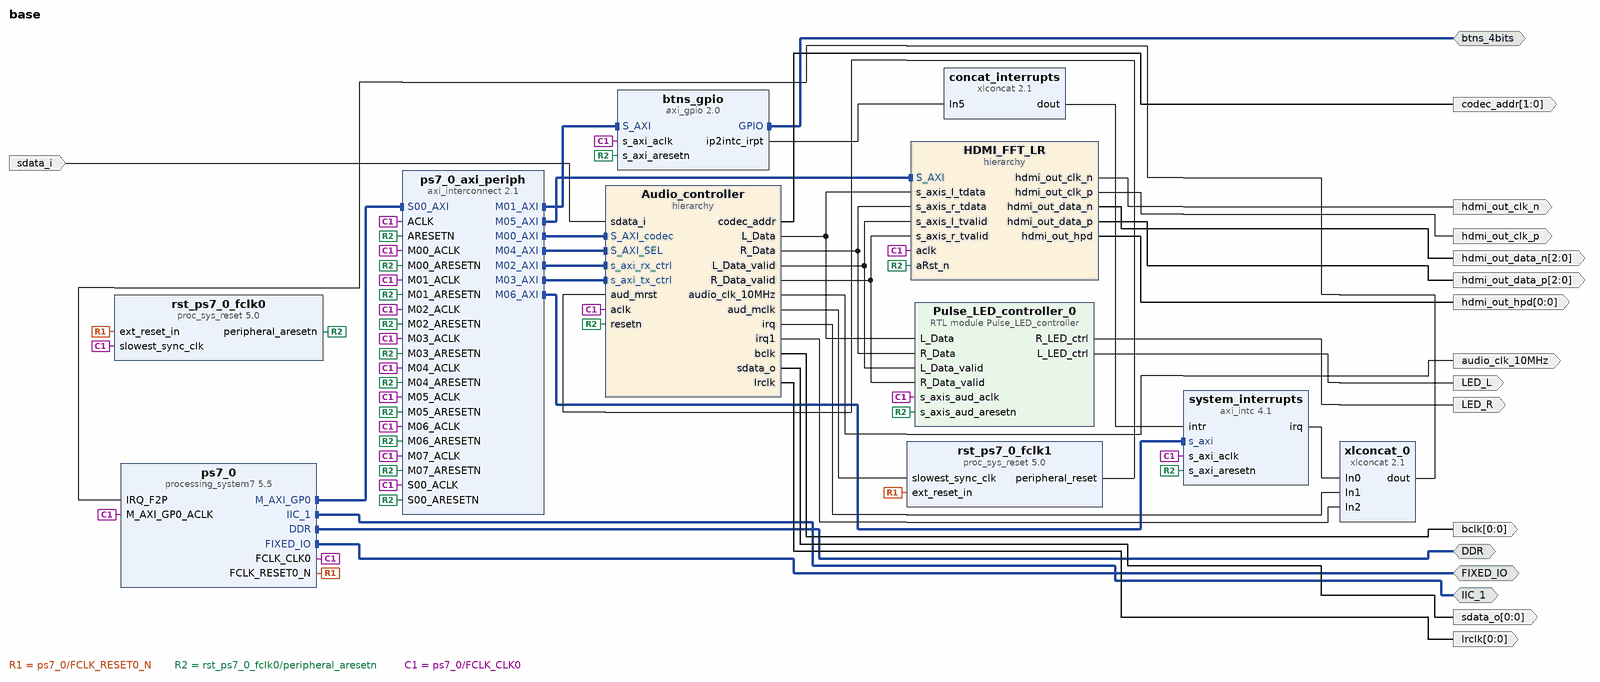
[diagram p0: block diagram of the top level]
# Vivado block design base, xc7z020clg400-1, Vivado 2020.2
create_bd_design base

create_bd_intf_port -mode Master -vlnv xilinx.com:interface:ddrx_rtl:1.0 DDR
create_bd_intf_port -mode Master -vlnv xilinx.com:display_processing_system7:fixedio_rtl:1.0 FIXED_IO
create_bd_intf_port -mode Master -vlnv xilinx.com:interface:iic_rtl:1.0 IIC_1
create_bd_intf_port -mode Master -vlnv xilinx.com:interface:gpio_rtl:1.0 btns_4bits
create_bd_port -dir O -type clk audio_clk_10MHz
create_bd_port -dir O -from 0 -to 0 bclk
create_bd_port -dir O -from 1 -to 0 codec_addr
create_bd_port -dir O -from 0 -to 0 lrclk
create_bd_port -dir I sdata_i
create_bd_port -dir O -from 0 -to 0 sdata_o
create_bd_port -dir O LED_L
create_bd_port -dir O LED_R
create_bd_port -dir O -type clk hdmi_out_clk_p
create_bd_port -dir O -type clk hdmi_out_clk_n
create_bd_port -dir O -from 2 -to 0 -type data hdmi_out_data_p
create_bd_port -dir O -from 2 -to 0 -type data hdmi_out_data_n
create_bd_port -dir O -from 0 -to 0 hdmi_out_hpd

create_bd_cell -type ip -vlnv xilinx.com:ip:processing_system7:5.5 ps7_0
set_property -dict [list \
  CONFIG.PCW_APU_PERIPHERAL_FREQMHZ 650 \
  CONFIG.PCW_CRYSTAL_PERIPHERAL_FREQMHZ 50 \
  CONFIG.PCW_ENET0_ENET0_IO {MIO 16 .. 27} \
  CONFIG.PCW_ENET0_GRP_MDIO_ENABLE 1 \
  CONFIG.PCW_ENET0_GRP_MDIO_IO {MIO 52 .. 53} \
  CONFIG.PCW_ENET0_PERIPHERAL_ENABLE 1 \
  CONFIG.PCW_FPGA0_PERIPHERAL_FREQMHZ 100 \
  CONFIG.PCW_FPGA1_PERIPHERAL_FREQMHZ 142 \
  CONFIG.PCW_FPGA2_PERIPHERAL_FREQMHZ 200 \
  CONFIG.PCW_FPGA3_PERIPHERAL_FREQMHZ 100 \
  CONFIG.PCW_GPIO_EMIO_GPIO_ENABLE 1 \
  CONFIG.PCW_GPIO_EMIO_GPIO_IO 10 \
  CONFIG.PCW_GPIO_EMIO_GPIO_WIDTH 10 \
  CONFIG.PCW_GPIO_MIO_GPIO_ENABLE 0 \
  CONFIG.PCW_I2C0_GRP_INT_ENABLE 1 \
  CONFIG.PCW_I2C0_GRP_INT_IO EMIO \
  CONFIG.PCW_I2C0_I2C0_IO {MIO 50 .. 51} \
  CONFIG.PCW_I2C0_PERIPHERAL_ENABLE 1 \
  CONFIG.PCW_I2C1_I2C1_IO EMIO \
  CONFIG.PCW_I2C1_PERIPHERAL_ENABLE 1 \
  CONFIG.PCW_I2C_PERIPHERAL_FREQMHZ 108.333336 \
  CONFIG.PCW_IRQ_F2P_INTR 1 \
  CONFIG.PCW_PERIPHERAL_BOARD_PRESET None \
  CONFIG.PCW_PRESET_BANK1_VOLTAGE {LVCMOS 1.8V} \
  CONFIG.PCW_QSPI_GRP_FBCLK_ENABLE 1 \
  CONFIG.PCW_QSPI_GRP_FBCLK_IO {MIO 8} \
  CONFIG.PCW_QSPI_GRP_SINGLE_SS_ENABLE 1 \
  CONFIG.PCW_QSPI_GRP_SINGLE_SS_IO {MIO 1 .. 6} \
  CONFIG.PCW_QSPI_PERIPHERAL_ENABLE 1 \
  CONFIG.PCW_QSPI_QSPI_IO {MIO 1 .. 6} \
  CONFIG.PCW_SD0_GRP_CD_ENABLE 1 \
  CONFIG.PCW_SD0_GRP_CD_IO {MIO 47} \
  CONFIG.PCW_SD0_GRP_WP_ENABLE 0 \
  CONFIG.PCW_SD0_PERIPHERAL_ENABLE 1 \
  CONFIG.PCW_SD0_SD0_IO {MIO 40 .. 45} \
  CONFIG.PCW_SDIO_PERIPHERAL_FREQMHZ 50 \
  CONFIG.PCW_SINGLE_QSPI_DATA_MODE x4 \
  CONFIG.PCW_UART0_PERIPHERAL_ENABLE 1 \
  CONFIG.PCW_UART0_UART0_IO {MIO 14 .. 15} \
  CONFIG.PCW_UART1_PERIPHERAL_ENABLE 0 \
  CONFIG.PCW_UART_PERIPHERAL_FREQMHZ 100 \
  CONFIG.PCW_UIPARAM_DDR_BUS_WIDTH {16 Bit} \
  CONFIG.PCW_UIPARAM_DDR_FREQ_MHZ 525 \
  CONFIG.PCW_UIPARAM_DDR_PARTNO Custom \
  CONFIG.PCW_USB0_PERIPHERAL_ENABLE 1 \
  CONFIG.PCW_USB0_USB0_IO {MIO 28 .. 39} \
  CONFIG.PCW_USE_FABRIC_INTERRUPT 1 \
] [get_bd_cells ps7_0]
# 486 more settings of ps7_0 are not shown: defaults, MIO pin electricals, DDR timing, and values the tool derives
create_bd_cell -type ip -vlnv xilinx.com:ip:proc_sys_reset:5.0 rst_ps7_0_fclk0
create_bd_cell -type ip -vlnv xilinx.com:ip:proc_sys_reset:5.0 rst_ps7_0_fclk1
create_bd_cell -type hier Audio_controller
create_bd_cell -type ip -vlnv xilinx.com:ip:axi_gpio:2.0 btns_gpio
set_property -dict {CONFIG.C_ALL_INPUTS 1 CONFIG.C_GPIO_WIDTH 4 CONFIG.C_INTERRUPT_PRESENT 1} [get_bd_cells btns_gpio]
create_bd_cell -type ip -vlnv xilinx.com:ip:xlconcat:2.1 concat_interrupts
set_property -dict {CONFIG.NUM_PORTS 7 CONFIG.dout_width 15} [get_bd_cells concat_interrupts]
create_bd_cell -type ip -vlnv xilinx.com:ip:axi_interconnect:2.1 ps7_0_axi_periph
set_property -dict {CONFIG.NUM_MI 8 CONFIG.NUM_SI 1} [get_bd_cells ps7_0_axi_periph]
create_bd_cell -type ip -vlnv xilinx.com:ip:axi_intc:4.1 system_interrupts
create_bd_cell -type ip -vlnv xilinx.com:ip:xlconcat:2.1 xlconcat_0
set_property -dict {CONFIG.NUM_PORTS 16 CONFIG.dout_width 16} [get_bd_cells xlconcat_0]
create_bd_cell -type module -reference Pulse_LED_controller Pulse_LED_controller_0
create_bd_cell -type hier HDMI_FFT_LR

# ---- hierarchy /Audio_controller ----
current_bd_instance /Audio_controller
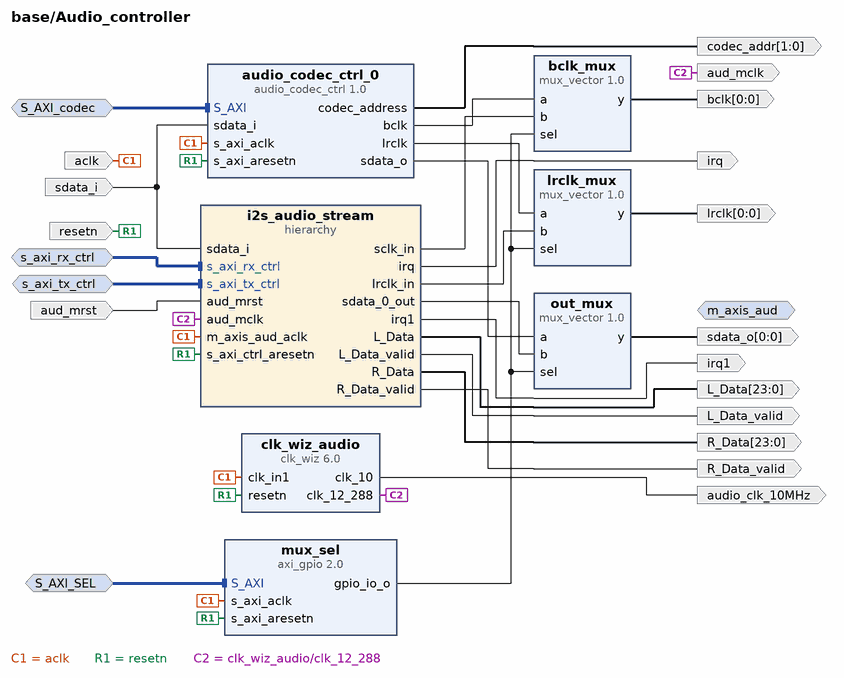
[diagram p1: block diagram inside /Audio_controller]
create_bd_intf_pin -mode Slave -vlnv xilinx.com:interface:aximm_rtl:1.0 S_AXI_codec
create_bd_intf_pin -mode Slave -vlnv xilinx.com:interface:aximm_rtl:1.0 S_AXI_SEL
create_bd_intf_pin -mode Slave -vlnv xilinx.com:interface:aximm_rtl:1.0 s_axi_rx_ctrl
create_bd_intf_pin -mode Slave -vlnv xilinx.com:interface:aximm_rtl:1.0 s_axi_tx_ctrl
create_bd_intf_pin -mode Master -vlnv xilinx.com:interface:axis_rtl:1.0 m_axis_aud
create_bd_pin -dir O -from 0 -to 0 bclk
create_bd_pin -dir I sdata_i
create_bd_pin -dir O -from 1 -to 0 codec_addr
create_bd_pin -dir I -type clk aclk
create_bd_pin -dir I -type rst resetn
create_bd_pin -dir O -from 0 -to 0 lrclk
create_bd_pin -dir O -type clk aud_mclk
create_bd_pin -dir O -from 0 -to 0 sdata_o
create_bd_pin -dir O -type clk audio_clk_10MHz
create_bd_pin -dir I -type rst aud_mrst
create_bd_pin -dir O -type intr irq
create_bd_pin -dir O -type intr irq1
create_bd_pin -dir O -from 23 -to 0 L_Data
create_bd_pin -dir O -from 23 -to 0 R_Data
create_bd_pin -dir O L_Data_valid
create_bd_pin -dir O R_Data_valid

create_bd_cell -type ip -vlnv xilinx.com:user:mux_vector:1.0 bclk_mux
set_property -dict {CONFIG.C_NUM_CHANNELS 2 CONFIG.C_SIZE 1 CONFIG.DELAY 0} [get_bd_cells bclk_mux]
create_bd_cell -type ip -vlnv xilinx.com:user:audio_codec_ctrl:1.0 audio_codec_ctrl_0
create_bd_cell -type ip -vlnv xilinx.com:user:mux_vector:1.0 lrclk_mux
set_property -dict {CONFIG.C_NUM_CHANNELS 2 CONFIG.C_SIZE 1 CONFIG.DELAY 0} [get_bd_cells lrclk_mux]
create_bd_cell -type ip -vlnv xilinx.com:user:mux_vector:1.0 out_mux
set_property -dict {CONFIG.C_NUM_CHANNELS 2 CONFIG.C_SIZE 1 CONFIG.DELAY 0} [get_bd_cells out_mux]
create_bd_cell -type hier i2s_audio_stream
create_bd_cell -type ip -vlnv xilinx.com:ip:clk_wiz:6.0 clk_wiz_audio
set_property -dict [list \
  CONFIG.CLKOUT1_JITTER 360.948 \
  CONFIG.CLKOUT1_PHASE_ERROR 301.601 \
  CONFIG.CLKOUT1_REQUESTED_OUT_FREQ 12.288 \
  CONFIG.CLKOUT2_JITTER 372.827 \
  CONFIG.CLKOUT2_PHASE_ERROR 301.601 \
  CONFIG.CLKOUT2_REQUESTED_OUT_FREQ 10 \
  CONFIG.CLKOUT2_USED true \
  CONFIG.CLK_OUT1_PORT clk_12_288 \
  CONFIG.CLK_OUT2_PORT clk_10 \
  CONFIG.MMCM_CLKFBOUT_MULT_F 48.000 \
  CONFIG.MMCM_CLKOUT0_DIVIDE_F 78.125 \
  CONFIG.MMCM_CLKOUT1_DIVIDE 96 \
  CONFIG.MMCM_DIVCLK_DIVIDE 5 \
  CONFIG.NUM_OUT_CLKS 2 \
  CONFIG.RESET_PORT resetn \
  CONFIG.RESET_TYPE ACTIVE_LOW \
  CONFIG.USE_LOCKED false \
] [get_bd_cells clk_wiz_audio]
create_bd_cell -type ip -vlnv xilinx.com:ip:axi_gpio:2.0 mux_sel
set_property -dict {CONFIG.C_ALL_OUTPUTS 1 CONFIG.C_GPIO_WIDTH 1} [get_bd_cells mux_sel]

# ---- hierarchy /Audio_controller/i2s_audio_stream ----
current_bd_instance /Audio_controller/i2s_audio_stream
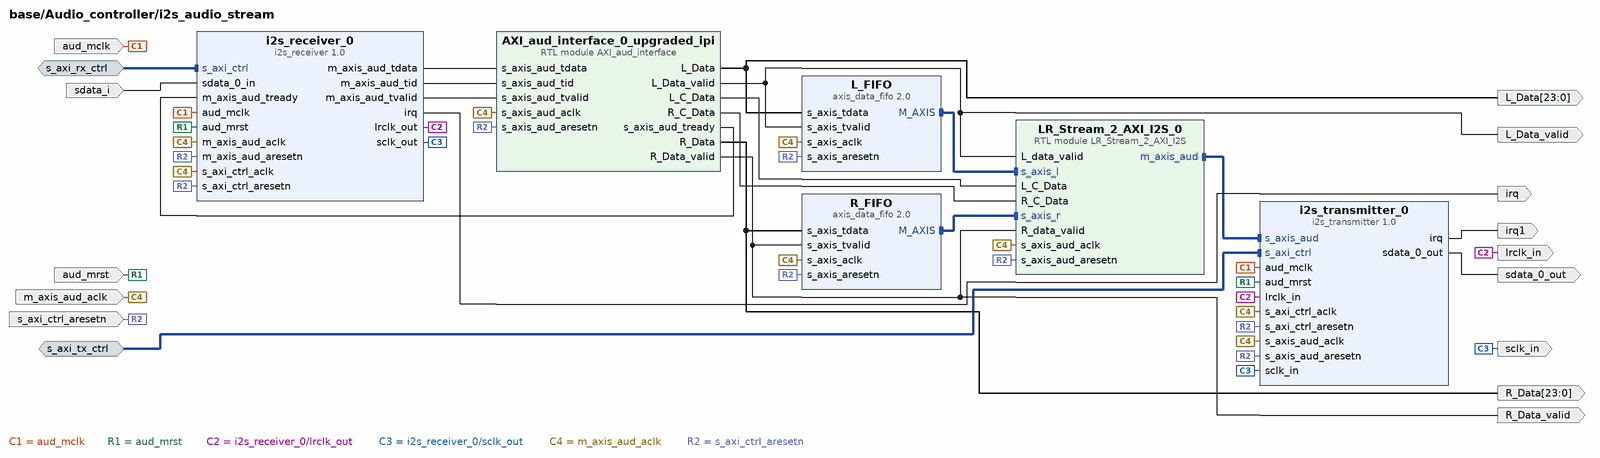
[diagram p2: block diagram inside /Audio_controller/i2s_audio_stream]
create_bd_intf_pin -mode Slave -vlnv xilinx.com:interface:aximm_rtl:1.0 s_axi_rx_ctrl
create_bd_intf_pin -mode Slave -vlnv xilinx.com:interface:aximm_rtl:1.0 s_axi_tx_ctrl
create_bd_pin -dir I -type clk m_axis_aud_aclk
create_bd_pin -dir I -type rst s_axi_ctrl_aresetn
create_bd_pin -dir I -type clk aud_mclk
create_bd_pin -dir I -type rst aud_mrst
create_bd_pin -dir O -type intr irq
create_bd_pin -dir O lrclk_in
create_bd_pin -dir O sclk_in
create_bd_pin -dir I sdata_i
create_bd_pin -dir O -type intr irq1
create_bd_pin -dir O sdata_0_out
create_bd_pin -dir O -from 23 -to 0 L_Data
create_bd_pin -dir O -from 23 -to 0 R_Data
create_bd_pin -dir O L_Data_valid
create_bd_pin -dir O R_Data_valid

create_bd_cell -type ip -vlnv xilinx.com:ip:i2s_receiver:1.0 i2s_receiver_0
set_property -dict {CONFIG.C_32BIT_LR 1 CONFIG.C_DEPTH 64 CONFIG.C_IS_MASTER 1} [get_bd_cells i2s_receiver_0]
create_bd_cell -type ip -vlnv xilinx.com:ip:i2s_transmitter:1.0 i2s_transmitter_0
set_property -dict [list \
  CONFIG.C_32BIT_LR 1 \
  CONFIG.C_DEPTH 64 \
  CONFIG.C_ENABLE_FIFO_COUNT false \
  CONFIG.C_IS_MASTER 0 \
] [get_bd_cells i2s_transmitter_0]
create_bd_cell -type ip -vlnv xilinx.com:ip:axis_data_fifo:2.0 L_FIFO
set_property -dict {CONFIG.FIFO_DEPTH 128 CONFIG.TDATA_NUM_BYTES 3} [get_bd_cells L_FIFO]
create_bd_cell -type ip -vlnv xilinx.com:ip:axis_data_fifo:2.0 R_FIFO
set_property -dict {CONFIG.FIFO_DEPTH 128 CONFIG.TDATA_NUM_BYTES 3} [get_bd_cells R_FIFO]
create_bd_cell -type module -reference LR_Stream_2_AXI_I2S LR_Stream_2_AXI_I2S_0
create_bd_cell -type module -reference AXI_aud_interface AXI_aud_interface_0_upgraded_ipi

# ---- hierarchy /HDMI_FFT_LR ----
current_bd_instance /HDMI_FFT_LR
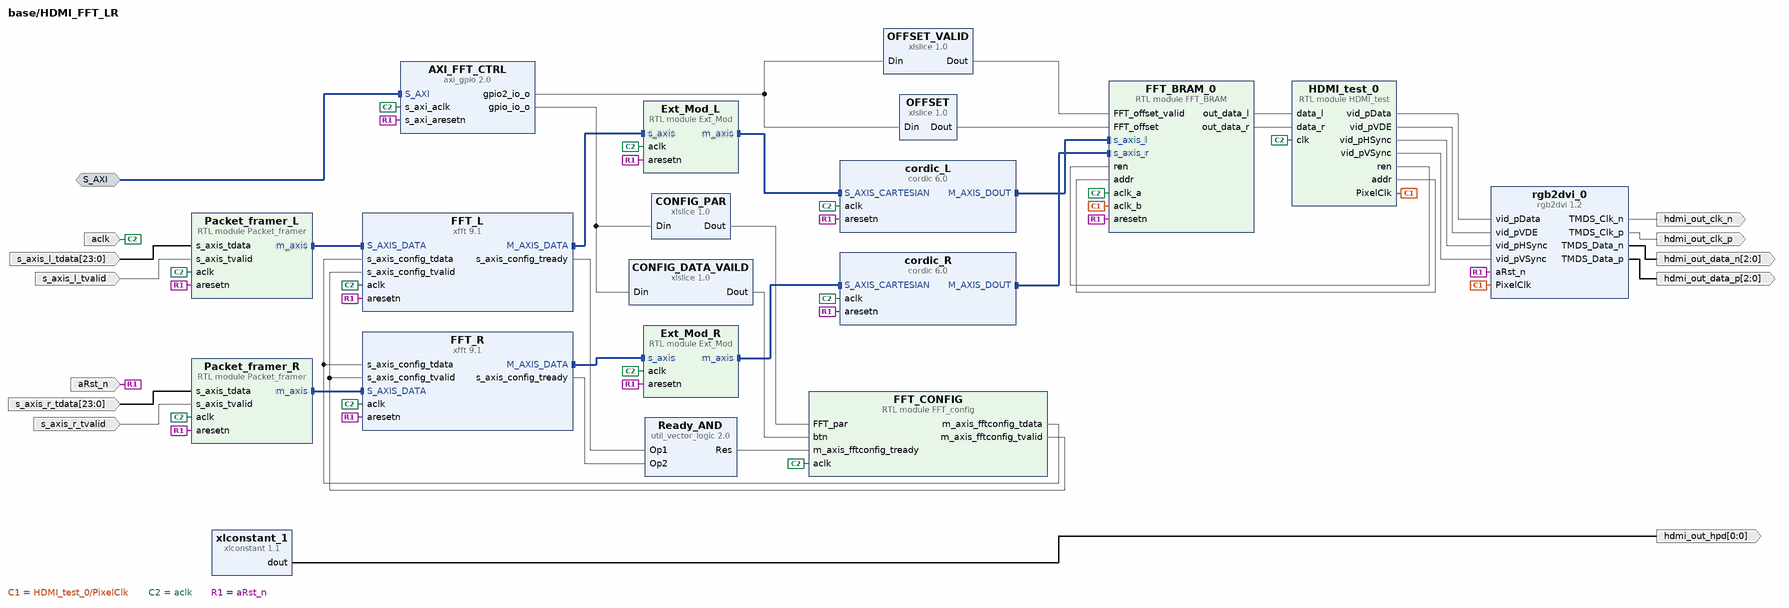
[diagram p3: block diagram inside /HDMI_FFT_LR]
create_bd_intf_pin -mode Slave -vlnv xilinx.com:interface:aximm_rtl:1.0 S_AXI
create_bd_pin -dir I -type clk aclk
create_bd_pin -dir I -type rst aRst_n
create_bd_pin -dir O -from 0 -to 0 hdmi_out_hpd
create_bd_pin -dir I -from 23 -to 0 s_axis_l_tdata
create_bd_pin -dir I s_axis_l_tvalid
create_bd_pin -dir O -type clk hdmi_out_clk_p
create_bd_pin -dir O -type clk hdmi_out_clk_n
create_bd_pin -dir O -from 2 -to 0 hdmi_out_data_p
create_bd_pin -dir O -from 2 -to 0 hdmi_out_data_n
create_bd_pin -dir I -from 23 -to 0 s_axis_r_tdata
create_bd_pin -dir I s_axis_r_tvalid

create_bd_cell -type module -reference FFT_config FFT_CONFIG
create_bd_cell -type ip -vlnv xilinx.com:ip:xfft:9.1 FFT_L
set_property -dict [list \
  CONFIG.aresetn true \
  CONFIG.channels 1 \
  CONFIG.data_format fixed_point \
  CONFIG.implementation_options pipelined_streaming_io \
  CONFIG.input_width 24 \
  CONFIG.number_of_stages_using_block_ram_for_data_and_phase_factors 3 \
  CONFIG.output_ordering natural_order \
  CONFIG.phase_factor_width 24 \
  CONFIG.scaling_options scaled \
  CONFIG.target_clock_frequency 100 \
  CONFIG.target_data_throughput 100 \
  CONFIG.transform_length 1024 \
  CONFIG.xk_index true \
] [get_bd_cells FFT_L]
create_bd_cell -type ip -vlnv xilinx.com:ip:util_vector_logic:2.0 Ready_AND
set_property -dict {CONFIG.C_SIZE 1} [get_bd_cells Ready_AND]
create_bd_cell -type ip -vlnv xilinx.com:ip:xlslice:1.0 OFFSET
set_property -dict {CONFIG.DIN_FROM 9 CONFIG.DIN_WIDTH 11 CONFIG.DOUT_WIDTH 10} [get_bd_cells OFFSET]
create_bd_cell -type ip -vlnv xilinx.com:ip:cordic:6.0 cordic_R
set_property -dict [list \
  CONFIG.ARESETN true \
  CONFIG.Coarse_Rotation false \
  CONFIG.Data_Format UnsignedInteger \
  CONFIG.Functional_Selection Square_Root \
  CONFIG.Input_Width 48 \
  CONFIG.Output_Width 25 \
  CONFIG.Round_Mode Truncate \
  CONFIG.cartesian_has_tlast true \
  CONFIG.cartesian_has_tuser true \
  CONFIG.cartesian_tuser_width 16 \
  CONFIG.flow_control Blocking \
  CONFIG.out_tlast_behv Pass_Cartesian_TLAST \
  CONFIG.out_tready true \
] [get_bd_cells cordic_R]
create_bd_cell -type module -reference Ext_Mod Ext_Mod_R
create_bd_cell -type ip -vlnv xilinx.com:ip:xlconstant:1.1 xlconstant_1
create_bd_cell -type ip -vlnv xilinx.com:ip:xlslice:1.0 OFFSET_VALID
set_property -dict {CONFIG.DIN_FROM 10 CONFIG.DIN_TO 10 CONFIG.DIN_WIDTH 11 CONFIG.DOUT_WIDTH 1} [get_bd_cells OFFSET_VALID]
create_bd_cell -type module -reference Packet_framer Packet_framer_L
set_property -dict {CONFIG.PACKET_N_DATA 1024} [get_bd_cells Packet_framer_L]
create_bd_cell -type ip -vlnv xilinx.com:ip:xfft:9.1 FFT_R
set_property -dict [list \
  CONFIG.aresetn true \
  CONFIG.channels 1 \
  CONFIG.data_format fixed_point \
  CONFIG.implementation_options pipelined_streaming_io \
  CONFIG.input_width 24 \
  CONFIG.number_of_stages_using_block_ram_for_data_and_phase_factors 3 \
  CONFIG.output_ordering natural_order \
  CONFIG.phase_factor_width 24 \
  CONFIG.scaling_options scaled \
  CONFIG.target_clock_frequency 100 \
  CONFIG.target_data_throughput 50 \
  CONFIG.transform_length 1024 \
  CONFIG.xk_index true \
] [get_bd_cells FFT_R]
create_bd_cell -type ip -vlnv digilentinc.com:ip:rgb2dvi:1.2 rgb2dvi_0
set_property -dict [list \
  CONFIG.kClkPrimitive MMCM \
  CONFIG.kClkRange 2 \
  CONFIG.kGenerateSerialClk true \
  CONFIG.kRstActiveHigh false \
] [get_bd_cells rgb2dvi_0]
create_bd_cell -type ip -vlnv xilinx.com:ip:xlslice:1.0 CONFIG_PAR
set_property -dict {CONFIG.DIN_FROM 15 CONFIG.DIN_WIDTH 17 CONFIG.DOUT_WIDTH 16} [get_bd_cells CONFIG_PAR]
create_bd_cell -type ip -vlnv xilinx.com:ip:xlslice:1.0 CONFIG_DATA_VAILD
set_property -dict {CONFIG.DIN_FROM 16 CONFIG.DIN_TO 16 CONFIG.DIN_WIDTH 17 CONFIG.DOUT_WIDTH 1} [get_bd_cells CONFIG_DATA_VAILD]
create_bd_cell -type ip -vlnv xilinx.com:ip:cordic:6.0 cordic_L
set_property -dict [list \
  CONFIG.ARESETN true \
  CONFIG.Coarse_Rotation false \
  CONFIG.Data_Format UnsignedInteger \
  CONFIG.Functional_Selection Square_Root \
  CONFIG.Input_Width 48 \
  CONFIG.Output_Width 25 \
  CONFIG.Round_Mode Truncate \
  CONFIG.cartesian_has_tlast true \
  CONFIG.cartesian_has_tuser true \
  CONFIG.cartesian_tuser_width 16 \
  CONFIG.flow_control Blocking \
  CONFIG.out_tlast_behv Pass_Cartesian_TLAST \
  CONFIG.out_tready true \
] [get_bd_cells cordic_L]
create_bd_cell -type module -reference FFT_BRAM FFT_BRAM_0
create_bd_cell -type module -reference Ext_Mod Ext_Mod_L
create_bd_cell -type ip -vlnv xilinx.com:ip:axi_gpio:2.0 AXI_FFT_CTRL
set_property -dict [list \
  CONFIG.C_ALL_OUTPUTS 1 \
  CONFIG.C_ALL_OUTPUTS_2 1 \
  CONFIG.C_GPIO2_WIDTH 11 \
  CONFIG.C_GPIO_WIDTH 17 \
  CONFIG.C_IS_DUAL 1 \
] [get_bd_cells AXI_FFT_CTRL]
create_bd_cell -type module -reference Packet_framer Packet_framer_R
set_property -dict {CONFIG.PACKET_N_DATA 1024} [get_bd_cells Packet_framer_R]
create_bd_cell -type module -reference HDMI_test HDMI_test_0

# ---- connections ----

current_bd_instance /Audio_controller
connect_bd_intf_net [get_bd_intf_pins s_axi_rx_ctrl] [get_bd_intf_pins i2s_audio_stream/s_axi_rx_ctrl]
connect_bd_intf_net [get_bd_intf_pins s_axi_tx_ctrl] [get_bd_intf_pins i2s_audio_stream/s_axi_tx_ctrl]
connect_bd_intf_net [get_bd_intf_pins S_AXI_SEL] [get_bd_intf_pins mux_sel/S_AXI]
connect_bd_intf_net [get_bd_intf_pins S_AXI_codec] [get_bd_intf_pins audio_codec_ctrl_0/S_AXI]
connect_bd_net [get_bd_pins audio_codec_ctrl_0/bclk] [get_bd_pins bclk_mux/a]
connect_bd_net -net i2s_receiver_0_sclk_out [get_bd_pins i2s_audio_stream/sclk_in] [get_bd_pins bclk_mux/b]
connect_bd_net -net axi_gpio_0_gpio_io_o [get_bd_pins mux_sel/gpio_io_o] \
  [get_bd_pins out_mux/sel] [get_bd_pins bclk_mux/sel] [get_bd_pins lrclk_mux/sel]
connect_bd_net [get_bd_pins audio_codec_ctrl_0/lrclk] [get_bd_pins lrclk_mux/a]
connect_bd_net [get_bd_pins audio_codec_ctrl_0/sdata_o] [get_bd_pins out_mux/a]
connect_bd_net -net i2s_receiver_0_lrclk_out [get_bd_pins i2s_audio_stream/lrclk_in] [get_bd_pins lrclk_mux/b]
connect_bd_net -net i2s_transmitter_0_sdata_0_out [get_bd_pins i2s_audio_stream/sdata_0_out] [get_bd_pins out_mux/b]
connect_bd_net [get_bd_pins bclk_mux/y] [get_bd_pins bclk]
connect_bd_net [get_bd_pins sdata_i] [get_bd_pins i2s_audio_stream/sdata_i] [get_bd_pins audio_codec_ctrl_0/sdata_i]
connect_bd_net [get_bd_pins audio_codec_ctrl_0/codec_address] [get_bd_pins codec_addr]
connect_bd_net -net ps7_0_FCLK_CLK0 [get_bd_pins aclk] \
  [get_bd_pins i2s_audio_stream/m_axis_aud_aclk] [get_bd_pins audio_codec_ctrl_0/s_axi_aclk] \
  [get_bd_pins clk_wiz_audio/clk_in1] [get_bd_pins mux_sel/s_axi_aclk]
connect_bd_net -net rst_ps7_0_fclk0_peripheral_aresetn [get_bd_pins resetn] \
  [get_bd_pins i2s_audio_stream/s_axi_ctrl_aresetn] [get_bd_pins audio_codec_ctrl_0/s_axi_aresetn] \
  [get_bd_pins clk_wiz_audio/resetn] [get_bd_pins mux_sel/s_axi_aresetn]
connect_bd_net [get_bd_pins lrclk_mux/y] [get_bd_pins lrclk]
connect_bd_net -net clk_wiz_18_432MHz_clk_out1 [get_bd_pins clk_wiz_audio/clk_12_288] [get_bd_pins aud_mclk] [get_bd_pins i2s_audio_stream/aud_mclk]
connect_bd_net -net mux_vector_0_y [get_bd_pins out_mux/y] [get_bd_pins sdata_o]
connect_bd_net -net rst_ps7_0_fclk1_peripheral_reset [get_bd_pins aud_mrst] [get_bd_pins i2s_audio_stream/aud_mrst]
connect_bd_net -net i2s_receiver_0_irq [get_bd_pins i2s_audio_stream/irq] [get_bd_pins irq]
connect_bd_net -net i2s_transmitter_0_irq [get_bd_pins i2s_audio_stream/irq1] [get_bd_pins irq1]
connect_bd_net [get_bd_pins i2s_audio_stream/L_Data] [get_bd_pins L_Data]
connect_bd_net [get_bd_pins i2s_audio_stream/R_Data] [get_bd_pins R_Data]
connect_bd_net [get_bd_pins i2s_audio_stream/L_Data_valid] [get_bd_pins L_Data_valid]
connect_bd_net [get_bd_pins i2s_audio_stream/R_Data_valid] [get_bd_pins R_Data_valid]
connect_bd_net -net clk_wiz_12_288MHz_clk_10 [get_bd_pins clk_wiz_audio/clk_10] [get_bd_pins audio_clk_10MHz]

current_bd_instance /Audio_controller/i2s_audio_stream
connect_bd_intf_net [get_bd_intf_pins s_axi_tx_ctrl] [get_bd_intf_pins i2s_transmitter_0/s_axi_ctrl]
connect_bd_intf_net [get_bd_intf_pins LR_Stream_2_AXI_I2S_0/m_axis_aud] [get_bd_intf_pins i2s_transmitter_0/s_axis_aud]
connect_bd_intf_net [get_bd_intf_pins LR_Stream_2_AXI_I2S_0/s_axis_r] [get_bd_intf_pins R_FIFO/M_AXIS]
connect_bd_intf_net [get_bd_intf_pins LR_Stream_2_AXI_I2S_0/s_axis_l] [get_bd_intf_pins L_FIFO/M_AXIS]
connect_bd_intf_net [get_bd_intf_pins s_axi_rx_ctrl] [get_bd_intf_pins i2s_receiver_0/s_axi_ctrl]
connect_bd_net -net clk_wiz_18_432MHz_clk_out1 [get_bd_pins aud_mclk] [get_bd_pins i2s_transmitter_0/aud_mclk] [get_bd_pins i2s_receiver_0/aud_mclk]
connect_bd_net -net rst_ps7_0_fclk1_peripheral_reset [get_bd_pins aud_mrst] \
  [get_bd_pins i2s_transmitter_0/aud_mrst] [get_bd_pins i2s_receiver_0/aud_mrst]
connect_bd_net [get_bd_pins i2s_receiver_0/irq] [get_bd_pins irq]
connect_bd_net [get_bd_pins i2s_receiver_0/lrclk_out] [get_bd_pins lrclk_in] [get_bd_pins i2s_transmitter_0/lrclk_in]
connect_bd_net [get_bd_pins i2s_receiver_0/sclk_out] [get_bd_pins sclk_in] [get_bd_pins i2s_transmitter_0/sclk_in]
connect_bd_net [get_bd_pins sdata_i] [get_bd_pins i2s_receiver_0/sdata_0_in]
connect_bd_net [get_bd_pins i2s_transmitter_0/irq] [get_bd_pins irq1]
connect_bd_net [get_bd_pins i2s_transmitter_0/sdata_0_out] [get_bd_pins sdata_0_out]
connect_bd_net [get_bd_pins m_axis_aud_aclk] \
  [get_bd_pins i2s_receiver_0/m_axis_aud_aclk] [get_bd_pins i2s_transmitter_0/s_axis_aud_aclk] \
  [get_bd_pins i2s_transmitter_0/s_axi_ctrl_aclk] [get_bd_pins i2s_receiver_0/s_axi_ctrl_aclk] \
  [get_bd_pins L_FIFO/s_axis_aclk] [get_bd_pins R_FIFO/s_axis_aclk] [get_bd_pins LR_Stream_2_AXI_I2S_0/s_axis_aud_aclk] \
  [get_bd_pins AXI_aud_interface_0_upgraded_ipi/s_axis_aud_aclk]
connect_bd_net [get_bd_pins s_axi_ctrl_aresetn] \
  [get_bd_pins i2s_receiver_0/m_axis_aud_aresetn] [get_bd_pins i2s_transmitter_0/s_axis_aud_aresetn] \
  [get_bd_pins i2s_transmitter_0/s_axi_ctrl_aresetn] [get_bd_pins i2s_receiver_0/s_axi_ctrl_aresetn] \
  [get_bd_pins L_FIFO/s_axis_aresetn] [get_bd_pins R_FIFO/s_axis_aresetn] \
  [get_bd_pins LR_Stream_2_AXI_I2S_0/s_axis_aud_aresetn] [get_bd_pins AXI_aud_interface_0_upgraded_ipi/s_axis_aud_aresetn]
connect_bd_net [get_bd_pins i2s_receiver_0/m_axis_aud_tdata] [get_bd_pins AXI_aud_interface_0_upgraded_ipi/s_axis_aud_tdata]
connect_bd_net [get_bd_pins i2s_receiver_0/m_axis_aud_tid] [get_bd_pins AXI_aud_interface_0_upgraded_ipi/s_axis_aud_tid]
connect_bd_net [get_bd_pins AXI_aud_interface_0_upgraded_ipi/L_Data] [get_bd_pins L_Data] [get_bd_pins L_FIFO/s_axis_tdata]
connect_bd_net [get_bd_pins AXI_aud_interface_0_upgraded_ipi/R_Data] [get_bd_pins R_Data] [get_bd_pins R_FIFO/s_axis_tdata]
connect_bd_net [get_bd_pins AXI_aud_interface_0_upgraded_ipi/L_Data_valid] \
  [get_bd_pins L_Data_valid] [get_bd_pins L_FIFO/s_axis_tvalid] [get_bd_pins LR_Stream_2_AXI_I2S_0/L_data_valid]
connect_bd_net [get_bd_pins AXI_aud_interface_0_upgraded_ipi/R_Data_valid] \
  [get_bd_pins R_Data_valid] [get_bd_pins R_FIFO/s_axis_tvalid] [get_bd_pins LR_Stream_2_AXI_I2S_0/R_data_valid]
connect_bd_net [get_bd_pins AXI_aud_interface_0_upgraded_ipi/s_axis_aud_tready] [get_bd_pins i2s_receiver_0/m_axis_aud_tready]
connect_bd_net [get_bd_pins i2s_receiver_0/m_axis_aud_tvalid] [get_bd_pins AXI_aud_interface_0_upgraded_ipi/s_axis_aud_tvalid]
connect_bd_net [get_bd_pins AXI_aud_interface_0_upgraded_ipi/L_C_Data] [get_bd_pins LR_Stream_2_AXI_I2S_0/L_C_Data]
connect_bd_net [get_bd_pins AXI_aud_interface_0_upgraded_ipi/R_C_Data] [get_bd_pins LR_Stream_2_AXI_I2S_0/R_C_Data]

current_bd_instance /HDMI_FFT_LR
connect_bd_intf_net [get_bd_intf_pins S_AXI] [get_bd_intf_pins AXI_FFT_CTRL/S_AXI]
connect_bd_intf_net [get_bd_intf_pins cordic_R/S_AXIS_CARTESIAN] [get_bd_intf_pins Ext_Mod_R/m_axis]
connect_bd_intf_net -intf_net Ext_Mod_0_m_axis [get_bd_intf_pins Ext_Mod_L/m_axis] [get_bd_intf_pins cordic_L/S_AXIS_CARTESIAN]
connect_bd_intf_net -intf_net cordic_0_M_AXIS_DOUT [get_bd_intf_pins cordic_L/M_AXIS_DOUT] [get_bd_intf_pins FFT_BRAM_0/s_axis_l]
connect_bd_intf_net [get_bd_intf_pins Ext_Mod_L/s_axis] [get_bd_intf_pins FFT_L/M_AXIS_DATA]
connect_bd_intf_net [get_bd_intf_pins Packet_framer_R/m_axis] [get_bd_intf_pins FFT_R/S_AXIS_DATA]
connect_bd_intf_net [get_bd_intf_pins Ext_Mod_R/s_axis] [get_bd_intf_pins FFT_R/M_AXIS_DATA]
connect_bd_intf_net [get_bd_intf_pins Packet_framer_L/m_axis] [get_bd_intf_pins FFT_L/S_AXIS_DATA]
connect_bd_intf_net [get_bd_intf_pins cordic_R/M_AXIS_DOUT] [get_bd_intf_pins FFT_BRAM_0/s_axis_r]
connect_bd_net -net xlslice_1_Dout [get_bd_pins CONFIG_PAR/Dout] [get_bd_pins FFT_CONFIG/FFT_par]
connect_bd_net -net xlslice_2_Dout [get_bd_pins CONFIG_DATA_VAILD/Dout] [get_bd_pins FFT_CONFIG/btn]
connect_bd_net [get_bd_pins FFT_CONFIG/m_axis_fftconfig_tdata] [get_bd_pins FFT_L/s_axis_config_tdata] [get_bd_pins FFT_R/s_axis_config_tdata]
connect_bd_net [get_bd_pins Ready_AND/Res] [get_bd_pins FFT_CONFIG/m_axis_fftconfig_tready]
connect_bd_net [get_bd_pins FFT_CONFIG/m_axis_fftconfig_tvalid] [get_bd_pins FFT_R/s_axis_config_tvalid] [get_bd_pins FFT_L/s_axis_config_tvalid]
connect_bd_net [get_bd_pins FFT_L/s_axis_config_tready] [get_bd_pins Ready_AND/Op1]
connect_bd_net [get_bd_pins FFT_R/s_axis_config_tready] [get_bd_pins Ready_AND/Op2]
connect_bd_net -net axi_gpio_0_gpio2_io_o [get_bd_pins AXI_FFT_CTRL/gpio2_io_o] [get_bd_pins OFFSET/Din] [get_bd_pins OFFSET_VALID/Din]
connect_bd_net -net xlslice_0_Dout [get_bd_pins OFFSET/Dout] [get_bd_pins FFT_BRAM_0/FFT_offset]
connect_bd_net -net xlslice_3_Dout [get_bd_pins OFFSET_VALID/Dout] [get_bd_pins FFT_BRAM_0/FFT_offset_valid]
connect_bd_net [get_bd_pins HDMI_test_0/vid_pData] [get_bd_pins rgb2dvi_0/vid_pData]
connect_bd_net [get_bd_pins HDMI_test_0/vid_pVDE] [get_bd_pins rgb2dvi_0/vid_pVDE]
connect_bd_net [get_bd_pins HDMI_test_0/vid_pHSync] [get_bd_pins rgb2dvi_0/vid_pHSync]
connect_bd_net [get_bd_pins HDMI_test_0/vid_pVSync] [get_bd_pins rgb2dvi_0/vid_pVSync]
connect_bd_net [get_bd_pins HDMI_test_0/PixelClk] [get_bd_pins rgb2dvi_0/PixelClk] [get_bd_pins FFT_BRAM_0/aclk_b]
connect_bd_net -net axi_gpio_0_gpio_io_o [get_bd_pins AXI_FFT_CTRL/gpio_io_o] [get_bd_pins CONFIG_PAR/Din] [get_bd_pins CONFIG_DATA_VAILD/Din]
connect_bd_net -net FFT_BRAM_0_out_data [get_bd_pins FFT_BRAM_0/out_data_l] [get_bd_pins HDMI_test_0/data_l]
connect_bd_net [get_bd_pins FFT_BRAM_0/out_data_r] [get_bd_pins HDMI_test_0/data_r]
connect_bd_net [get_bd_pins HDMI_test_0/ren] [get_bd_pins FFT_BRAM_0/ren]
connect_bd_net [get_bd_pins HDMI_test_0/addr] [get_bd_pins FFT_BRAM_0/addr]
connect_bd_net -net ps7_0_FCLK_CLK0 [get_bd_pins aclk] \
  [get_bd_pins FFT_L/aclk] [get_bd_pins cordic_L/aclk] [get_bd_pins AXI_FFT_CTRL/s_axi_aclk] [get_bd_pins Ext_Mod_L/aclk] \
  [get_bd_pins Packet_framer_L/aclk] [get_bd_pins Packet_framer_R/aclk] [get_bd_pins FFT_R/aclk] [get_bd_pins Ext_Mod_R/aclk] \
  [get_bd_pins cordic_R/aclk] [get_bd_pins FFT_BRAM_0/aclk_a] [get_bd_pins HDMI_test_0/clk] [get_bd_pins FFT_CONFIG/aclk]
connect_bd_net -net rst_ps7_0_fclk0_peripheral_aresetn [get_bd_pins aRst_n] \
  [get_bd_pins rgb2dvi_0/aRst_n] [get_bd_pins cordic_L/aresetn] [get_bd_pins AXI_FFT_CTRL/s_axi_aresetn] \
  [get_bd_pins Ext_Mod_L/aresetn] [get_bd_pins Packet_framer_L/aresetn] [get_bd_pins Packet_framer_R/aresetn] \
  [get_bd_pins Ext_Mod_R/aresetn] [get_bd_pins cordic_R/aresetn] [get_bd_pins FFT_BRAM_0/aresetn] [get_bd_pins FFT_R/aresetn] \
  [get_bd_pins FFT_L/aresetn]
connect_bd_net [get_bd_pins xlconstant_1/dout] [get_bd_pins hdmi_out_hpd]
connect_bd_net -net Audio_controller_L_Data [get_bd_pins s_axis_l_tdata] [get_bd_pins Packet_framer_L/s_axis_tdata]
connect_bd_net -net Audio_controller_L_Data_valid [get_bd_pins s_axis_l_tvalid] [get_bd_pins Packet_framer_L/s_axis_tvalid]
connect_bd_net [get_bd_pins rgb2dvi_0/TMDS_Clk_p] [get_bd_pins hdmi_out_clk_p]
connect_bd_net [get_bd_pins rgb2dvi_0/TMDS_Clk_n] [get_bd_pins hdmi_out_clk_n]
connect_bd_net [get_bd_pins rgb2dvi_0/TMDS_Data_p] [get_bd_pins hdmi_out_data_p]
connect_bd_net [get_bd_pins rgb2dvi_0/TMDS_Data_n] [get_bd_pins hdmi_out_data_n]
connect_bd_net -net Audio_controller_R_Data [get_bd_pins s_axis_r_tdata] [get_bd_pins Packet_framer_R/s_axis_tdata]
connect_bd_net -net Audio_controller_R_Data_valid [get_bd_pins s_axis_r_tvalid] [get_bd_pins Packet_framer_R/s_axis_tvalid]

current_bd_instance /
connect_bd_intf_net [get_bd_intf_ports btns_4bits] [get_bd_intf_pins btns_gpio/GPIO]
connect_bd_intf_net [get_bd_intf_pins ps7_0_axi_periph/M00_AXI] [get_bd_intf_pins Audio_controller/S_AXI_codec]
connect_bd_intf_net [get_bd_intf_pins ps7_0/M_AXI_GP0] [get_bd_intf_pins ps7_0_axi_periph/S00_AXI]
connect_bd_intf_net [get_bd_intf_pins ps7_0_axi_periph/M04_AXI] [get_bd_intf_pins Audio_controller/S_AXI_SEL]
connect_bd_intf_net [get_bd_intf_pins ps7_0_axi_periph/M02_AXI] [get_bd_intf_pins Audio_controller/s_axi_rx_ctrl]
connect_bd_intf_net [get_bd_intf_pins ps7_0_axi_periph/M03_AXI] [get_bd_intf_pins Audio_controller/s_axi_tx_ctrl]
connect_bd_intf_net [get_bd_intf_ports IIC_1] [get_bd_intf_pins ps7_0/IIC_1]
connect_bd_intf_net [get_bd_intf_pins ps7_0_axi_periph/M05_AXI] [get_bd_intf_pins HDMI_FFT_LR/S_AXI]
connect_bd_intf_net [get_bd_intf_pins ps7_0_axi_periph/M06_AXI] [get_bd_intf_pins system_interrupts/s_axi]
connect_bd_intf_net [get_bd_intf_ports DDR] [get_bd_intf_pins ps7_0/DDR]
connect_bd_intf_net -intf_net processing_system7_0_FIXED_IO [get_bd_intf_ports FIXED_IO] [get_bd_intf_pins ps7_0/FIXED_IO]
connect_bd_intf_net [get_bd_intf_pins ps7_0_axi_periph/M01_AXI] [get_bd_intf_pins btns_gpio/S_AXI]
connect_bd_net -net audio_codec_ctrl_0_codec_address [get_bd_pins Audio_controller/codec_addr] [get_bd_ports codec_addr]
connect_bd_net -net clk_wiz_10MHz_clk_out1 [get_bd_pins Audio_controller/audio_clk_10MHz] [get_bd_ports audio_clk_10MHz]
connect_bd_net [get_bd_pins ps7_0/FCLK_RESET0_N] [get_bd_pins rst_ps7_0_fclk0/ext_reset_in] [get_bd_pins rst_ps7_0_fclk1/ext_reset_in]
connect_bd_net [get_bd_pins rst_ps7_0_fclk0/peripheral_aresetn] \
  [get_bd_pins Audio_controller/resetn] [get_bd_pins btns_gpio/s_axi_aresetn] [get_bd_pins ps7_0_axi_periph/ARESETN] \
  [get_bd_pins ps7_0_axi_periph/S00_ARESETN] [get_bd_pins ps7_0_axi_periph/M00_ARESETN] \
  [get_bd_pins ps7_0_axi_periph/M01_ARESETN] [get_bd_pins ps7_0_axi_periph/M02_ARESETN] \
  [get_bd_pins ps7_0_axi_periph/M03_ARESETN] [get_bd_pins ps7_0_axi_periph/M04_ARESETN] \
  [get_bd_pins ps7_0_axi_periph/M05_ARESETN] [get_bd_pins ps7_0_axi_periph/M06_ARESETN] \
  [get_bd_pins ps7_0_axi_periph/M07_ARESETN] [get_bd_pins system_interrupts/s_axi_aresetn] \
  [get_bd_pins Pulse_LED_controller_0/s_axis_aud_aresetn] [get_bd_pins HDMI_FFT_LR/aRst_n]
connect_bd_net [get_bd_pins system_interrupts/irq] [get_bd_pins xlconcat_0/In0]
connect_bd_net [get_bd_pins xlconcat_0/dout] [get_bd_pins ps7_0/IRQ_F2P]
connect_bd_net -net mux_vector_0_y [get_bd_pins Audio_controller/sdata_o] [get_bd_ports sdata_o]
connect_bd_net -net i2s_receiver_0_irq [get_bd_pins Audio_controller/irq] [get_bd_pins xlconcat_0/In1]
connect_bd_net -net i2s_transmitter_0_irq [get_bd_pins Audio_controller/irq1] [get_bd_pins xlconcat_0/In2]
connect_bd_net [get_bd_ports sdata_i] [get_bd_pins Audio_controller/sdata_i]
connect_bd_net -net bclk_mux_y [get_bd_pins Audio_controller/bclk] [get_bd_ports bclk]
connect_bd_net -net lrclk_mux_y [get_bd_pins Audio_controller/lrclk] [get_bd_ports lrclk]
connect_bd_net -net clk_wiz_18_432MHz_clk_out1 [get_bd_pins Audio_controller/aud_mclk] [get_bd_pins rst_ps7_0_fclk1/slowest_sync_clk]
connect_bd_net [get_bd_pins ps7_0/FCLK_CLK0] \
  [get_bd_pins ps7_0/M_AXI_GP0_ACLK] [get_bd_pins rst_ps7_0_fclk0/slowest_sync_clk] [get_bd_pins Audio_controller/aclk] \
  [get_bd_pins btns_gpio/s_axi_aclk] [get_bd_pins ps7_0_axi_periph/ACLK] [get_bd_pins ps7_0_axi_periph/S00_ACLK] \
  [get_bd_pins ps7_0_axi_periph/M00_ACLK] [get_bd_pins ps7_0_axi_periph/M01_ACLK] [get_bd_pins ps7_0_axi_periph/M02_ACLK] \
  [get_bd_pins ps7_0_axi_periph/M03_ACLK] [get_bd_pins ps7_0_axi_periph/M04_ACLK] [get_bd_pins ps7_0_axi_periph/M05_ACLK] \
  [get_bd_pins ps7_0_axi_periph/M06_ACLK] [get_bd_pins ps7_0_axi_periph/M07_ACLK] [get_bd_pins system_interrupts/s_axi_aclk] \
  [get_bd_pins Pulse_LED_controller_0/s_axis_aud_aclk] [get_bd_pins HDMI_FFT_LR/aclk]
connect_bd_net [get_bd_pins concat_interrupts/dout] [get_bd_pins system_interrupts/intr]
connect_bd_net [get_bd_pins btns_gpio/ip2intc_irpt] [get_bd_pins concat_interrupts/In5]
connect_bd_net [get_bd_pins Audio_controller/L_Data] [get_bd_pins Pulse_LED_controller_0/L_Data] [get_bd_pins HDMI_FFT_LR/s_axis_l_tdata]
connect_bd_net [get_bd_pins Audio_controller/R_Data] [get_bd_pins Pulse_LED_controller_0/R_Data] [get_bd_pins HDMI_FFT_LR/s_axis_r_tdata]
connect_bd_net [get_bd_pins Audio_controller/L_Data_valid] [get_bd_pins Pulse_LED_controller_0/L_Data_valid] [get_bd_pins HDMI_FFT_LR/s_axis_l_tvalid]
connect_bd_net [get_bd_pins Audio_controller/R_Data_valid] [get_bd_pins Pulse_LED_controller_0/R_Data_valid] [get_bd_pins HDMI_FFT_LR/s_axis_r_tvalid]
connect_bd_net [get_bd_pins rst_ps7_0_fclk1/peripheral_reset] [get_bd_pins Audio_controller/aud_mrst]
connect_bd_net [get_bd_pins Pulse_LED_controller_0/R_LED_ctrl] [get_bd_ports LED_R]
connect_bd_net [get_bd_pins Pulse_LED_controller_0/L_LED_ctrl] [get_bd_ports LED_L]
connect_bd_net -net rgb2dvi_0_TMDS_Clk_p [get_bd_pins HDMI_FFT_LR/hdmi_out_clk_p] [get_bd_ports hdmi_out_clk_p]
connect_bd_net -net rgb2dvi_0_TMDS_Clk_n [get_bd_pins HDMI_FFT_LR/hdmi_out_clk_n] [get_bd_ports hdmi_out_clk_n]
connect_bd_net -net rgb2dvi_0_TMDS_Data_p [get_bd_pins HDMI_FFT_LR/hdmi_out_data_p] [get_bd_ports hdmi_out_data_p]
connect_bd_net -net rgb2dvi_0_TMDS_Data_n [get_bd_pins HDMI_FFT_LR/hdmi_out_data_n] [get_bd_ports hdmi_out_data_n]
connect_bd_net -net xlconstant_1_dout [get_bd_pins HDMI_FFT_LR/hdmi_out_hpd] [get_bd_ports hdmi_out_hpd]
set_property HDL_ATTRIBUTE.BMM_INFO_PROCESSOR {arm > base iop_pmoda/mb_bram_ctrl base iop_pmodb/mb_bram_ctrl base iop_arduino/mb_bram_ctrl base iop_rpi/mb_bram_ctrl} [get_bd_cells ps7_0]
set_property HDL_ATTRIBUTE.KEEP_HIERARCHY yes [get_bd_cells ps7_0]
set_property PFM.AXI_PORT {  S_AXI_ACP {memport "S_AXI_ACP"}  S_AXI_HP1 {memport "S_AXI_HP"}  S_AXI_HP3 {memport "S_AXI_HP"}  } [get_bd_cells ps7_0]
set_property PFM.CLOCK {  FCLK_CLK0 {id "0" is_default "true"  proc_sys_reset "rst_ps7_0_fclk0" status "fixed"}  FCLK_CLK1 {id "1" is_default "false"  proc_sys_reset "rst_ps7_0_fclk1" status "fixed"}  FCLK_CLK3 {id "3" is_default "false"  proc_sys_reset "rst_ps7_0_fclk3" status "fixed"}  } [get_bd_cells ps7_0]

# ---- address map ----
assign_bd_address -offset 0x40000000 -range 64K -target_address_space [get_bd_addr_spaces ps7_0/Data] [get_bd_addr_segs Audio_controller/i2s_audio_stream/i2s_transmitter_0/s_axi_ctrl/Reg]
assign_bd_address -offset 0x41200000 -range 64K -target_address_space [get_bd_addr_spaces ps7_0/Data] [get_bd_addr_segs HDMI_FFT_LR/AXI_FFT_CTRL/S_AXI/Reg]
assign_bd_address -offset 0x41210000 -range 64K -target_address_space [get_bd_addr_spaces ps7_0/Data] [get_bd_addr_segs btns_gpio/S_AXI/Reg]
assign_bd_address -offset 0x41260000 -range 64K -target_address_space [get_bd_addr_spaces ps7_0/Data] [get_bd_addr_segs Audio_controller/mux_sel/S_AXI/Reg]
assign_bd_address -offset 0x41800000 -range 64K -target_address_space [get_bd_addr_spaces ps7_0/Data] [get_bd_addr_segs system_interrupts/S_AXI/Reg]
assign_bd_address -offset 0x43C00000 -range 64K -target_address_space [get_bd_addr_spaces ps7_0/Data] [get_bd_addr_segs Audio_controller/audio_codec_ctrl_0/S_AXI/reg0]
assign_bd_address -offset 0x7FFF8000 -range 32K -target_address_space [get_bd_addr_spaces ps7_0/Data] [get_bd_addr_segs Audio_controller/i2s_audio_stream/i2s_receiver_0/s_axi_ctrl/Reg]

validate_bd_design
save_bd_design
